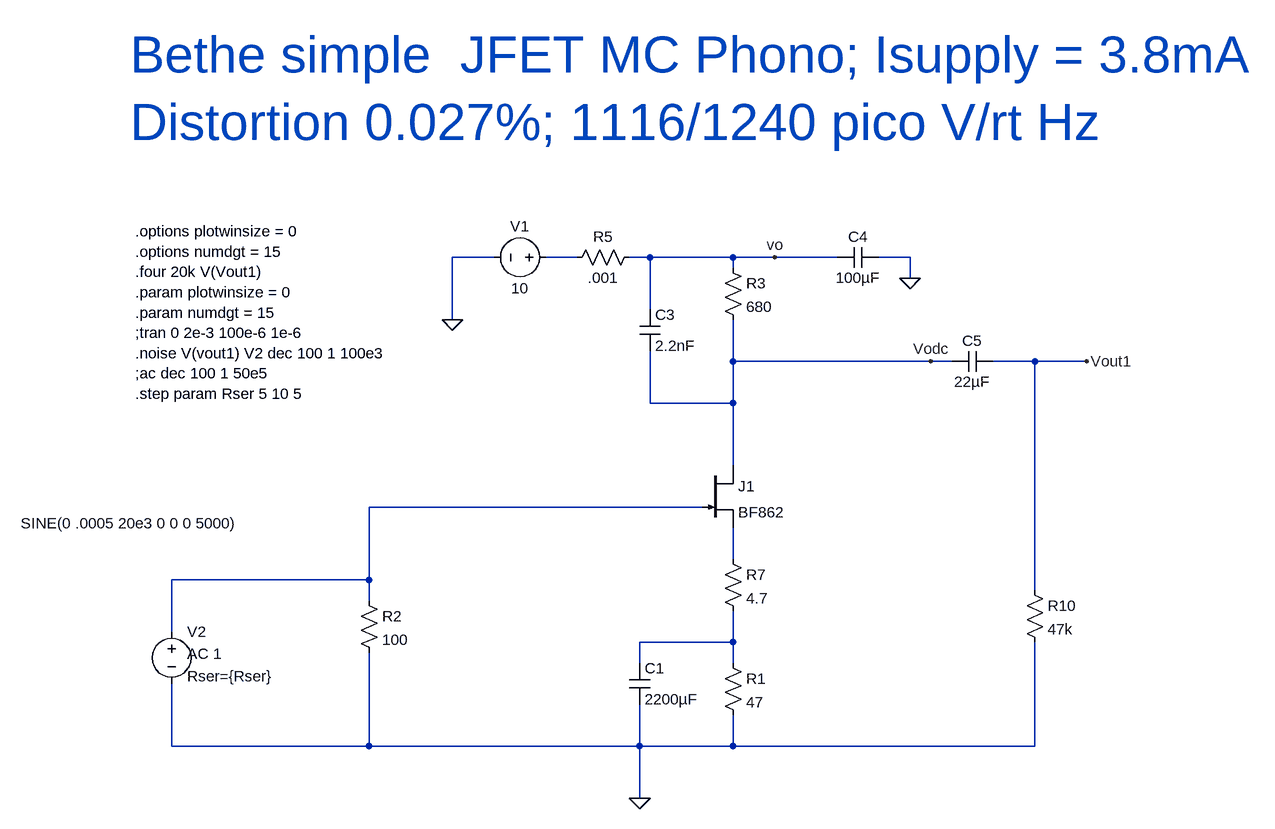
[diagram p0: schematic Bethe.asc]
Bethe.asc, the LTspice schematic file:
Version 4
SHEET 1 2136 680
WIRE 240 -384 176 -384
WIRE 368 -384 320 -384
WIRE 480 -384 448 -384
WIRE 608 -384 480 -384
WIRE 672 -384 608 -384
WIRE 768 -384 672 -384
WIRE 880 -384 832 -384
WIRE 608 -368 608 -384
WIRE 880 -352 880 -384
WIRE 480 -304 480 -384
WIRE 176 -288 176 -384
WIRE 608 -224 608 -288
WIRE 912 -224 608 -224
WIRE 944 -224 912 -224
WIRE 1072 -224 1008 -224
WIRE 1152 -224 1072 -224
WIRE 480 -160 480 -240
WIRE 608 -160 608 -224
WIRE 608 -160 480 -160
WIRE 608 -64 608 -160
WIRE 560 0 48 0
WIRE 608 80 608 32
WIRE 48 112 48 0
WIRE 48 112 -256 112
WIRE 1072 128 1072 -224
WIRE 48 144 48 112
WIRE -256 192 -256 112
WIRE 608 208 608 160
WIRE 608 208 464 208
WIRE 464 240 464 208
WIRE 608 240 608 208
WIRE -256 368 -256 272
WIRE 48 368 48 224
WIRE 48 368 -256 368
WIRE 464 368 464 304
WIRE 464 368 48 368
WIRE 608 368 608 320
WIRE 608 368 464 368
WIRE 1072 368 1072 208
WIRE 1072 368 608 368
WIRE 464 448 464 368
FLAG 464 448 0
FLAG 176 -288 0
FLAG 880 -352 0
FLAG 1152 -224 Vout1
FLAG 912 -224 Vodc
FLAG 672 -384 vo
SYMBOL njf 560 -64 R0
SYMATTR InstName J1
SYMATTR Value BF862
SYMBOL res 592 224 R0
SYMATTR InstName R1
SYMATTR Value 47
SYMBOL res 592 -384 R0
SYMATTR InstName R3
SYMATTR Value 680
SYMBOL voltage 336 -384 R90
WINDOW 0 -32 56 VBottom 2
WINDOW 3 32 56 VTop 2
WINDOW 123 2 56 VBottom 2
WINDOW 39 0 0 Left 2
SYMATTR InstName V1
SYMATTR Value 10
SYMBOL voltage -256 176 R0
WINDOW 3 -232 -151 Left 2
WINDOW 123 24 50 Left 2
WINDOW 39 24 84 Left 2
SYMATTR Value SINE(0 .0005 20e3 0 0 0 5000)
SYMATTR Value2 AC 1
SYMATTR SpiceLine Rser={Rser}
SYMATTR InstName V2
SYMBOL cap 832 -400 R90
WINDOW 0 0 32 VBottom 2
WINDOW 3 32 32 VTop 2
SYMATTR InstName C4
SYMATTR Value 100µF
SYMBOL res 32 128 R0
SYMATTR InstName R2
SYMATTR Value 100
SYMBOL cap 464 -304 R0
SYMATTR InstName C3
SYMATTR Value 2.2nF
SYMBOL cap 1008 -240 R90
WINDOW 0 0 32 VBottom 2
WINDOW 3 32 32 VTop 2
SYMATTR InstName C5
SYMATTR Value 22µF
SYMBOL res 1056 112 R0
SYMATTR InstName R10
SYMATTR Value 47k
SYMBOL res 464 -400 R90
WINDOW 0 0 56 VBottom 2
WINDOW 3 32 56 VTop 2
SYMATTR InstName R5
SYMATTR Value .001
SYMBOL cap 448 240 R0
SYMATTR InstName C1
SYMATTR Value 2200µF
SYMBOL res 592 64 R0
SYMATTR InstName R7
SYMATTR Value 4.7
TEXT -312 -424 Left 2 !.options plotwinsize = 0\n.options numdgt = 15\n.four 20k V(Vout1)\n.param plotwinsize = 0\n.param numdgt = 15\n;tran 0 2e-3 100e-6 1e-6\n.noise V(vout1) V2 dec 100 1 100e3\n;ac dec 100 1 50e5\n.step param Rser 5 10 5
TEXT -320 -696 Left 6 ;Bethe simple  JFET MC Phono; Isupply = 3.8mA\nDistortion 0.027%; 1116/1240 pico V/rt Hz

The netlist it stands for:
* Bethe.asc
J1 Vodc N002 N003 BF862
R1 N004 0 47
R3 vo Vodc 680
V1 N001 0 10
V2 N002 0 SINE(0 .0005 20e3 0 0 0 5000) AC 1 Rser={Rser}
C4 0 vo 100µF
R2 N002 0 100
C3 vo Vodc 2.2nF
C5 Vout1 Vodc 22µF
R10 Vout1 0 47k
R5 vo N001 .001
C1 N004 0 2200µF
R7 N003 N004 4.7
.model NJF NJF
.model PJF PJF
.lib standard.jft
.options plotwinsize = 0
.options numdgt = 15
.four 20k V(Vout1)
.param plotwinsize = 0
.param numdgt = 15
;tran 0 2e-3 100e-6 1e-6
.noise V(vout1) V2 dec 100 1 100e3
;ac dec 100 1 50e5
.step param Rser 5 10 5
* Bethe simple  JFET MC Phono; Isupply = 3.8mA
* Distortion 0.027%; 1116/1240 pico V/rt Hz
.backanno
.end